# EAGLE design me433 (EAGLE 9.6.2)
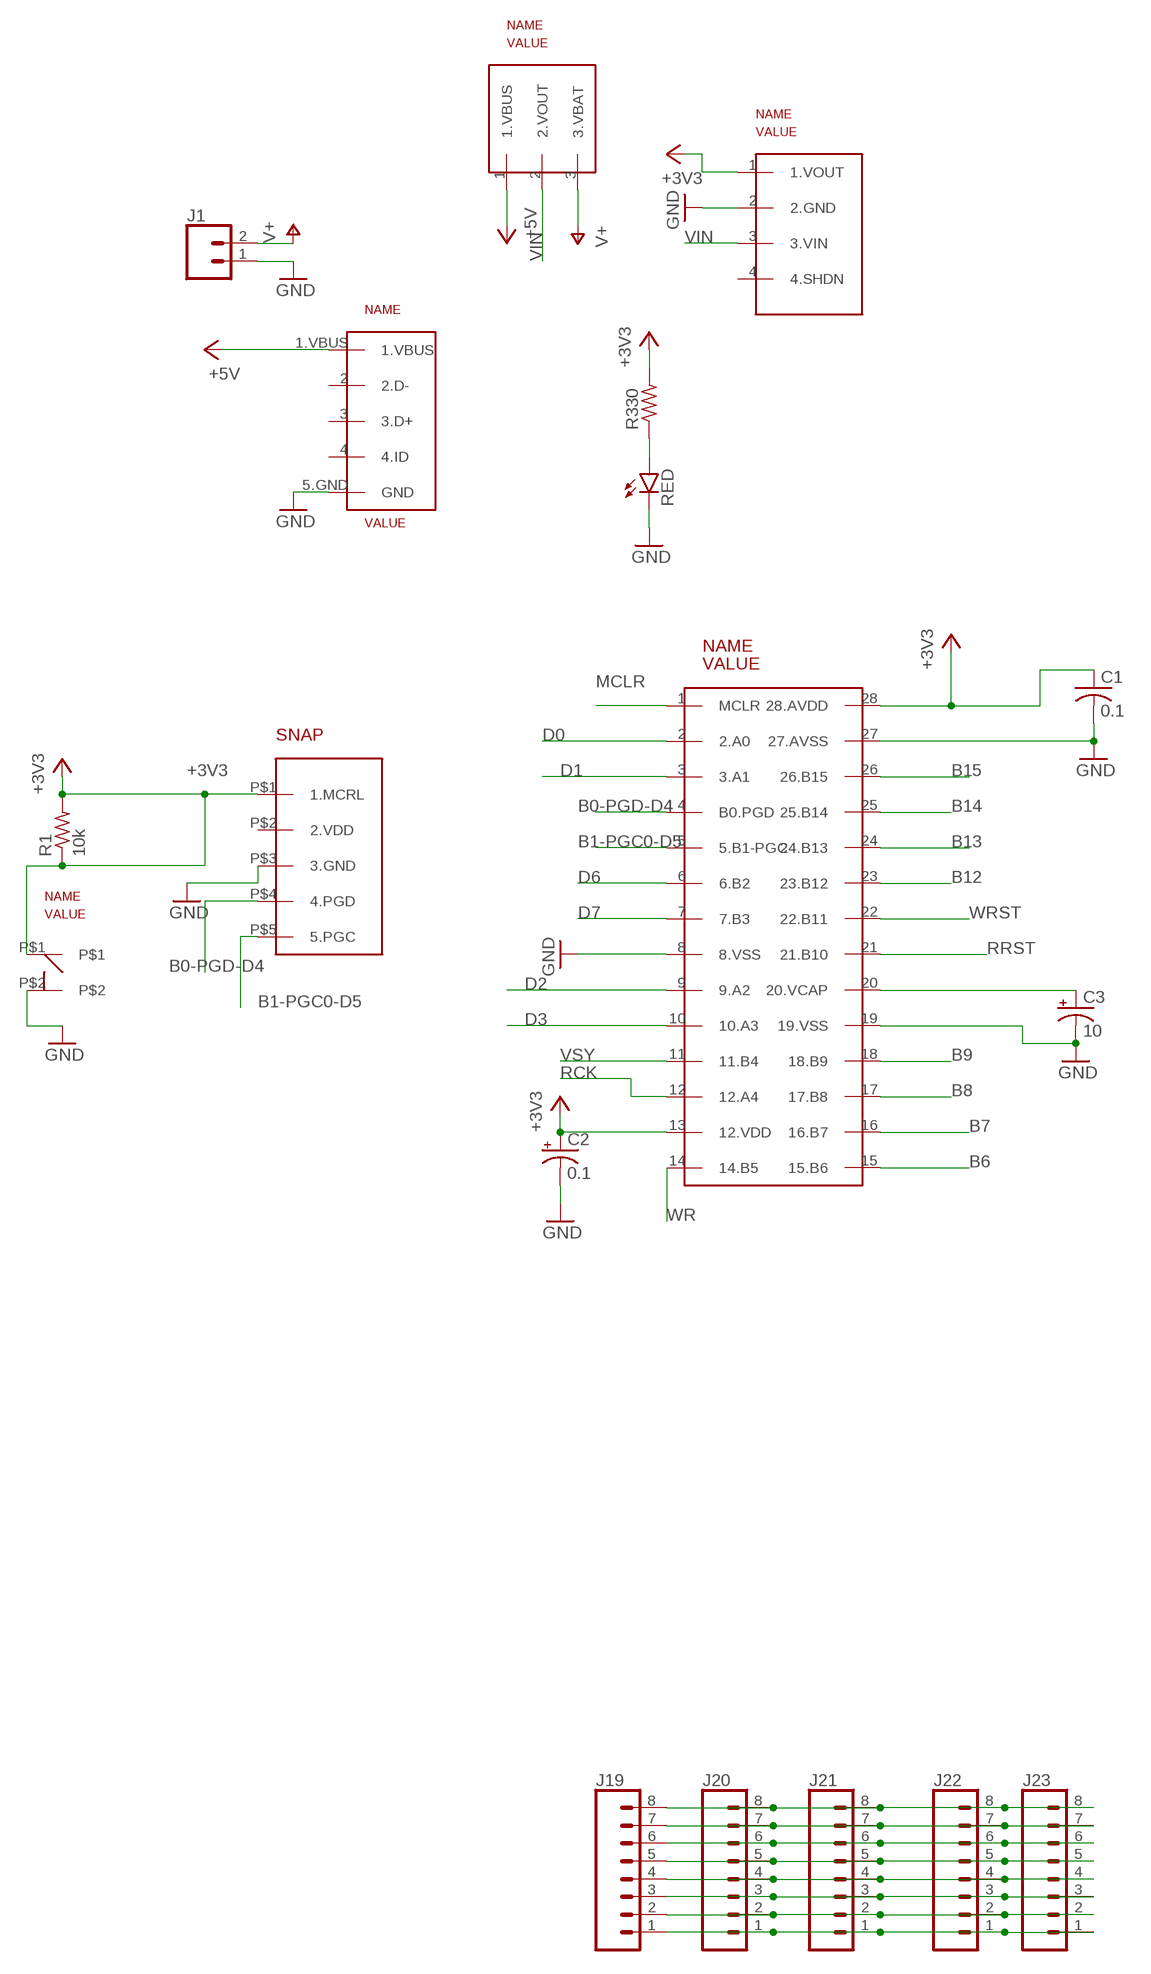
[diagram p0: schematic, sheet 1, part 1 of 2]
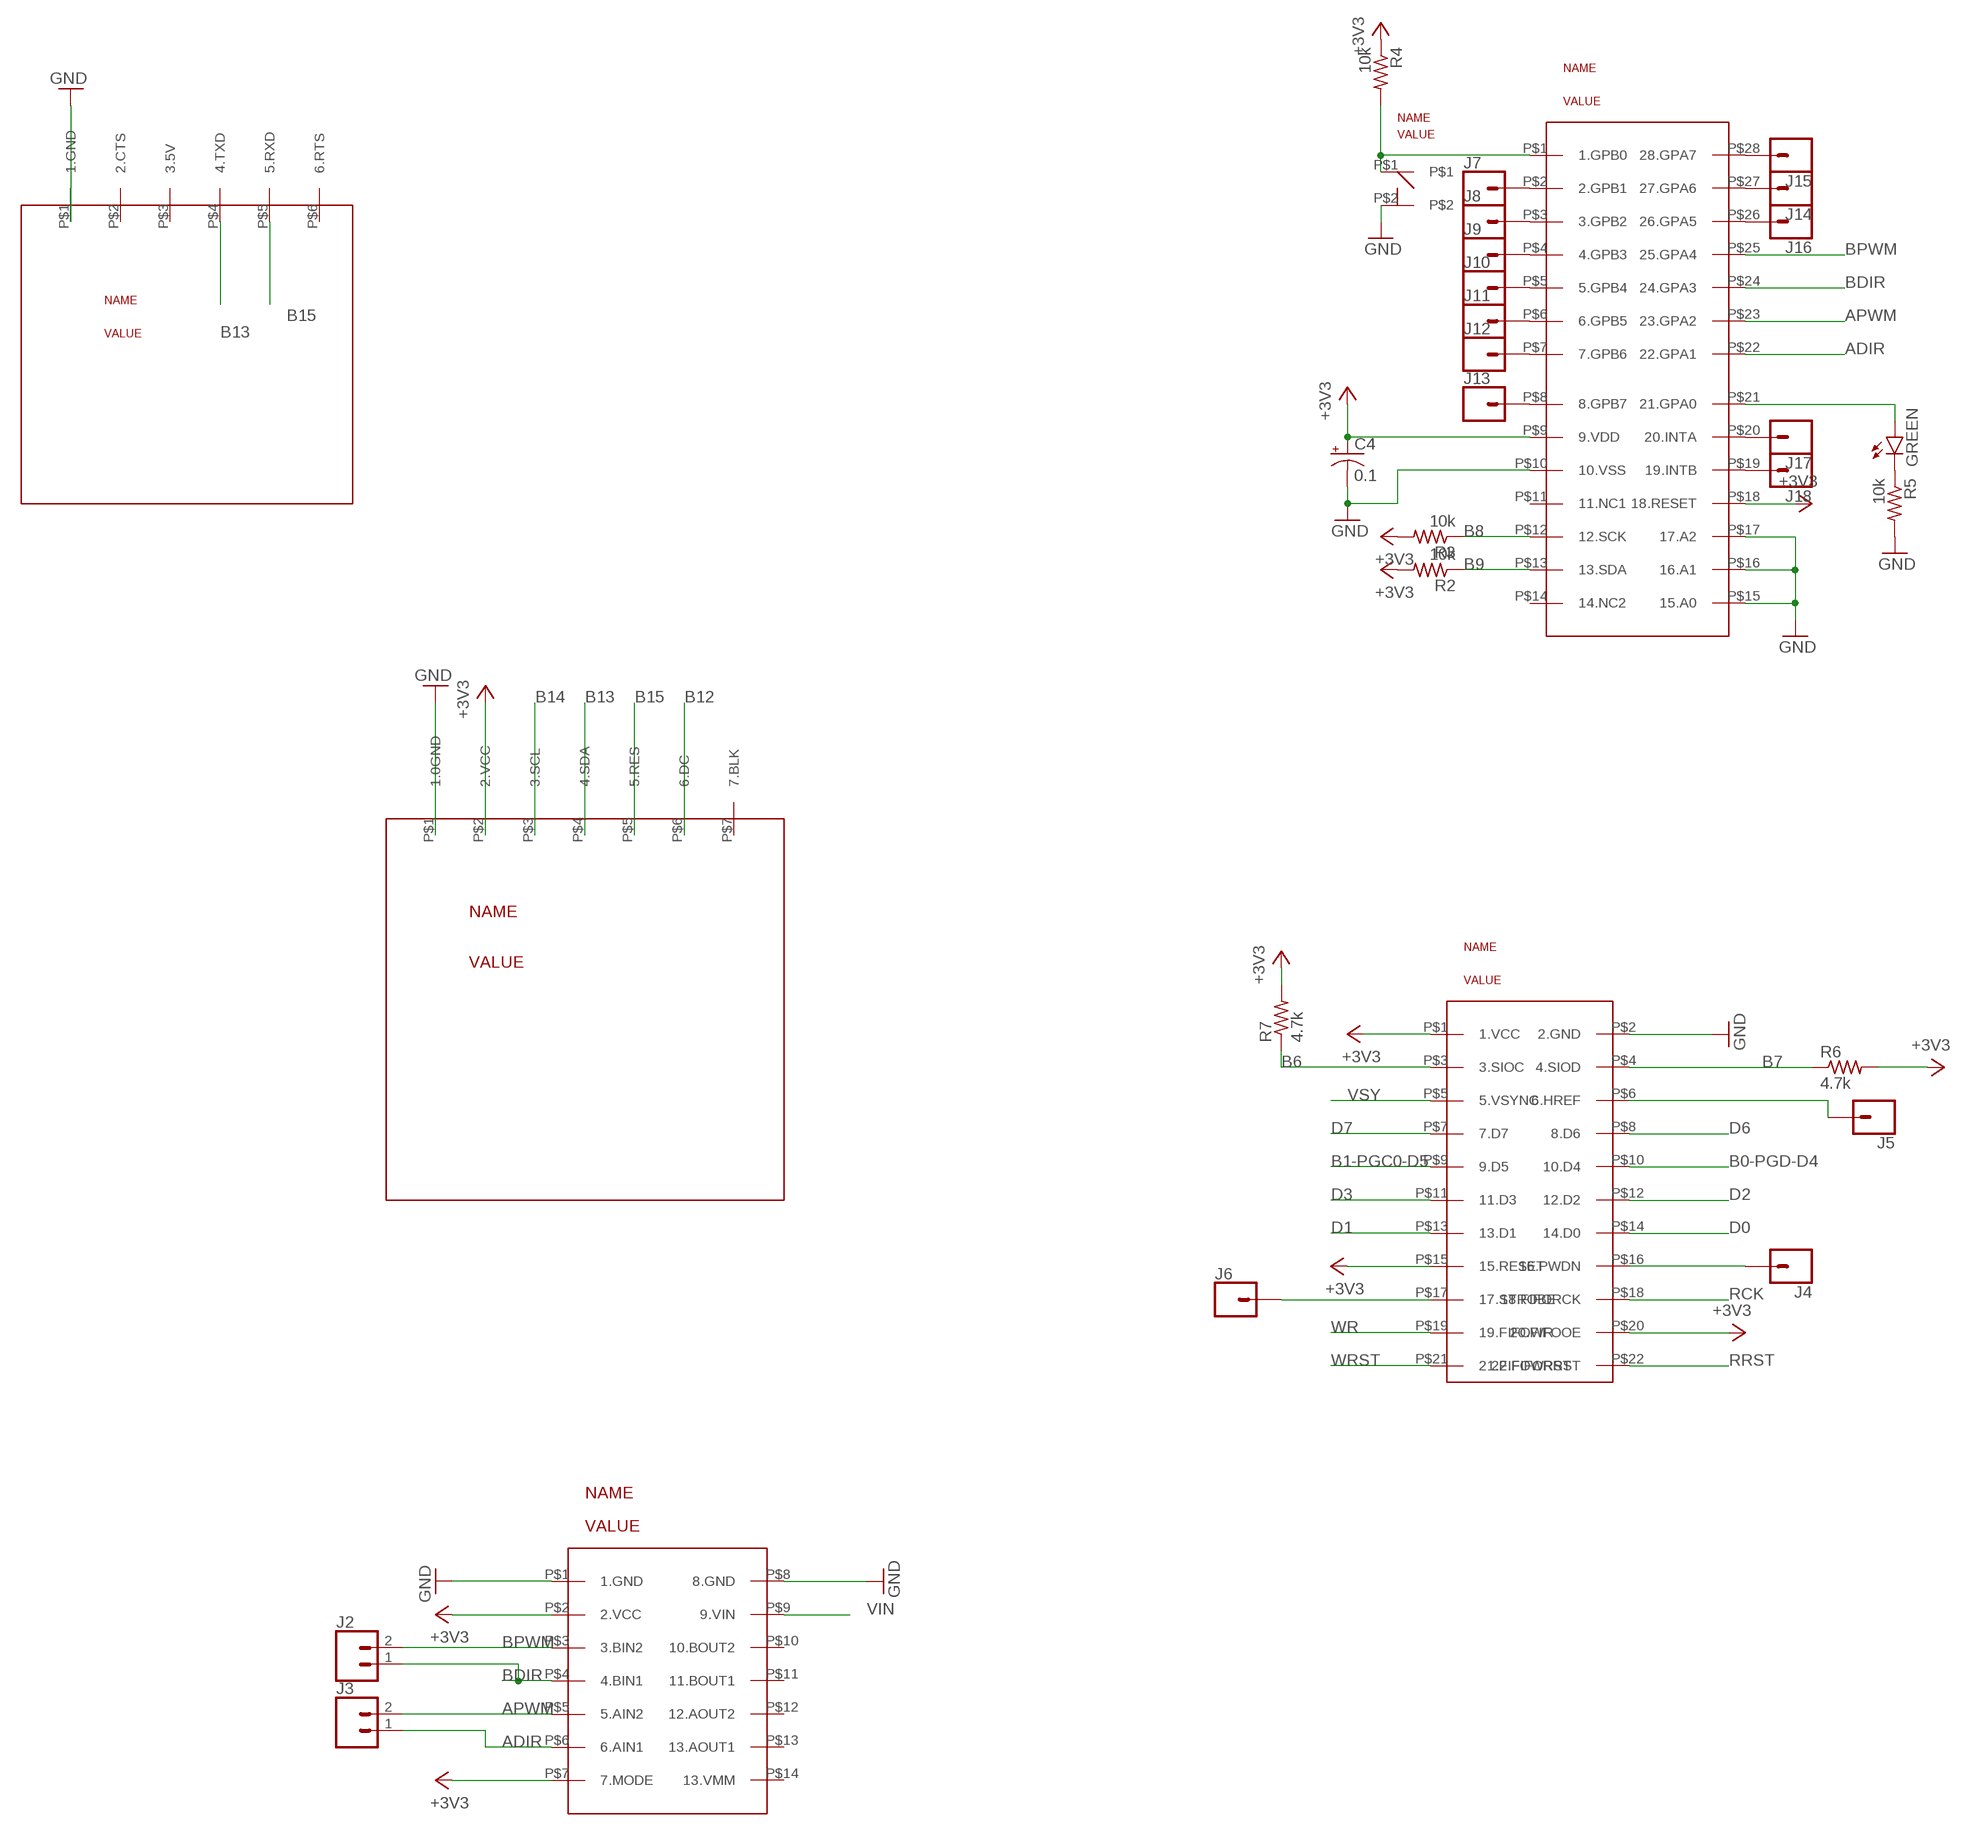
[diagram p1: schematic, sheet 1, part 2 of 2]

## Parts
C1  0.1  C-US025-030X050  [C025-030X050]
C2  0.1  CPOL-USB45181C  [B45181C]
C3  10  CPOL-USB45181C  [B45181C]
C4  0.1  CPOL-USB45181C  [B45181C]
GREEN  LED3MM  [LED3MM]
HBRIDGE  H_BRIDGE  [H_BRIDGE]
J1  CONN_02  [1X02]
J2  CONN_02  [1X02]
J3  CONN_02  [1X02]
J4  CONN_01  [1X01]
J5  CONN_01  [1X01]
J6  CONN_01  [1X01]
J7  CONN_01  [1X01]
J8  CONN_01  [1X01]
J9  CONN_01  [1X01]
J10  CONN_01  [1X01]
J11  CONN_01  [1X01]
J12  CONN_01  [1X01]
J13  CONN_01  [1X01]
J14  CONN_01  [1X01]
J15  CONN_01  [1X01]
J16  CONN_01  [1X01]
J17  CONN_01  [1X01]
J18  CONN_01  [1X01]
J19  CONN_08"  [1X08]
J20  CONN_08"  [1X08]
J21  CONN_08"  [1X08]
J22  CONN_08"  [1X08]
J23  CONN_08"  [1X08]
R1  10k  R-US_0207/10  [0207/10]
R2  10k  R-US_0207/10  [0207/10]
R3  10k  R-US_0207/10  [0207/10]
R4  10k  R-US_0207/10  [0207/10]
R5  10k  R-US_0207/10  [0207/10]
R6  4.7k  R-US_0207/10  [0207/10]
R7  4.7k  R-US_0207/10  [0207/10]
R330  R-US_0207/10  [0207/10]
RED  LED3MM  [LED3MM]
RESET  PUSH  [PUSH]
U$1  PIC32  [DIL28-3]
U$2  MICROUSB  [MICROUSB]
U$3  POLULU3V3  [POLOLU3V3]
U$4  SLIDE  [SLIDE]
U$5  FIFO_CAMERA  [FIFO_CAMERA]
U$6  SNAP  [SNAP]
U$7  USB_CON  [USB_CON]
U$8  LCD  [LCD]
U$10  EXPANDER  [EXPANDER]
USER  PUSH  [PUSH]

## Nets
+3V3: C1.1 C2.+ C4.+ HBRIDGE.P$2(2.VCC) HBRIDGE.P$7(7.MODE) R1.1 R1.2 R2.2 R3.2 R4.1 R6.2 R7.2 R330.2 RESET.P$1 U$1.13(12.VDD) U$1.28(28.AVDD) U$3.1(1.VOUT) U$5.P$1(1.VCC) U$5.P$15(15.RESET) U$5.P$20(20.FIFOOE) U$6.P$1(1.MCRL) U$8.P$2(2.VCC) U$10.P$9(9.VDD) U$10.P$18(18.RESET)
+5V: U$2.1.VBUS U$4.1(1.VBUS)
ADIR: HBRIDGE.P$6(6.AIN1) J3.1 U$10.P$22(22.GPA1)
APWM: HBRIDGE.P$5(5.AIN2) J3.2 U$10.P$23(23.GPA2)
B0-PGD-D4: U$1.4(B0.PGD) U$5.P$10(10.D4) U$6.P$4(4.PGD)
B1-PGC0-D5: U$1.5(5.B1-PGC) U$5.P$9(9.D5) U$6.P$5(5.PGC)
B6: R7.1 U$1.15(15.B6) U$5.P$3(3.SIOC)
B7: R6.1 U$1.16(16.B7) U$5.P$4(4.SIOD)
B8: R3.1 U$1.17(17.B8) U$10.P$12(12.SCK)
B9: R2.1 U$1.18(18.B9) U$10.P$13(13.SDA)
B12: U$1.23(23.B12) U$8.P$6(6.DC)
B13: U$1.24(24.B13) U$7.P$4(4.TXD) U$8.P$4(4.SDA)
B14: U$1.25(25.B14) U$8.P$3(3.SCL)
B15: U$1.26(26.B15) U$7.P$5(5.RXD) U$8.P$5(5.RES)
BDIR: HBRIDGE.P$4(4.BIN1) J2.1 U$10.P$24(24.GPA3)
BPWM: HBRIDGE.P$3(3.BIN2) J2.2 U$10.P$25(25.GPA4)
D0: U$1.2(2.A0) U$5.P$14(14.D0)
D1: U$1.3(3.A1) U$5.P$13(13.D1)
D2: U$1.9(9.A2) U$5.P$12(12.D2)
D3: U$1.10(10.A3) U$5.P$11(11.D3)
D6: U$1.6(6.B2) U$5.P$8(8.D6)
D7: U$1.7(7.B3) U$5.P$7(7.D7)
GND: C1.2 C2.- C3.- C4.- HBRIDGE.P$1(1.GND) HBRIDGE.P$8(8.GND) J1.1 R5.2 RED.K(C) RESET.P$2 U$1.8(8.VSS) U$1.19(19.VSS) U$1.27(27.AVSS) U$2.5.GND(GND) U$3.2(2.GND) U$5.P$2(2.GND) U$6.P$3(3.GND) U$7.P$1(1.GND) U$8.P$1(1.0GND) U$10.P$10(10.VSS) U$10.P$15(15.A0) U$10.P$16(16.A1) U$10.P$17(17.A2) USER.P$2
MCLR: U$1.1(MCLR)
N$1: C3.+ U$1.20(20.VCAP)
N$2: R330.1 RED.A
N$3: GREEN.A U$10.P$21(21.GPA0)
N$4: R4.2 U$10.P$1(1.GPB0) USER.P$1
N$5: GREEN.K(C) R5.1
N$6: J6.1 U$5.P$17(17.STROBE)
N$7: J4.1 U$5.P$16(16.PWDN)
N$8: J5.1 U$5.P$6(6.HREF)
N$9: J7.1 U$10.P$2(2.GPB1)
N$10: J8.1 U$10.P$3(3.GPB2)
N$11: J9.1 U$10.P$4(4.GPB3)
N$12: J10.1 U$10.P$5(5.GPB4)
N$13: J11.1 U$10.P$6(6.GPB5)
N$14: J12.1 U$10.P$7(7.GPB6)
N$15: J13.1 U$10.P$8(8.GPB7)
N$16: J14.1 U$10.P$27(27.GPA6)
N$17: J15.1 U$10.P$28(28.GPA7)
N$18: J16.1 U$10.P$26(26.GPA5)
N$19: J17.1 U$10.P$20(20.INTA)
N$20: J18.1 U$10.P$19(19.INTB)
N$21: J19.8 J20.8 J21.8 J22.8 J23.8
N$22: J19.7 J20.7 J21.7 J22.7 J23.7
N$23: J19.6 J20.6 J21.6 J22.6 J23.6
N$24: J19.5 J20.5 J21.5 J22.5 J23.5
N$25: J19.4 J20.4 J21.4 J22.4 J23.4
N$26: J19.3 J20.3 J21.3 J22.3 J23.3
N$27: J19.2 J20.2 J21.2 J22.2 J23.2
N$28: J19.1 J20.1 J21.1 J22.1 J23.1
RCK: U$1.12(12.A4) U$5.P$18(18.FIFORCK)
RRST: U$1.21(21.B10) U$5.P$22(22.FIFORRST)
V+: J1.2 U$4.3(3.VBAT)
VIN: HBRIDGE.P$9(9.VIN) U$3.3(3.VIN) U$4.2(2.VOUT)
VSY: U$1.11(11.B4) U$5.P$5(5.VSYNC)
WR: U$1.14(14.B5) U$5.P$19(19.FIFOWR)
WRST: U$1.22(22.B11) U$5.P$21(21.FIFOWRST)
Unconnected: HBRIDGE.P$10(10.BOUT2) HBRIDGE.P$11(11.BOUT1) HBRIDGE.P$12(12.AOUT2) HBRIDGE.P$13(13.AOUT1) HBRIDGE.P$14(13.VMM) U$2.2(2.D-) U$2.3(3.D+) U$2.4(4.ID) U$3.4(4.SHDN) U$6.P$2(2.VDD) U$7.P$2(2.CTS) U$7.P$3(3.5V) U$7.P$6(6.RTS) U$8.P$7(7.BLK) U$10.P$11(11.NC1) U$10.P$14(14.NC2)

## Library data of the parts
C1 = library:C-US: CAPACITOR, American symbol; SPICEPREFIX: C
C2-C4 = library:CPOL-US: POLARIZED CAPACITOR, American symbol; SPICEPREFIX: C
GREEN RED = library:LED: LED OSRAM: - CHIPLED LG R971, LG N971, LY N971, LG Q971, LY Q971, LO R971, LY R971 LH N974, LH R974 LS Q976, LO Q976, LY Q976 LO Q996 - Hyper CHIPLED LW Q18S LB Q993, LB Q99A, LB R99A - SideLED LS A670, LO A670, LY A670, LG A670, LP A670 LB A673, LV A673, LT A673, LW A673 LH A674 LY A675 LS A676, LA A676, LO A676, LY A676, LW A676 LS A679, LY A679, LG A679 - Hyper Micro SIDELED® LS Y876, LA Y876, LO Y876, LY Y876 LT Y87S - SmartLED LW L88C, LW L88S LB L89C, LB L89S, LG L890 LS L89K, LO L89K, LY L89K LS L896, LA L896, LO L896, LY L896 - TOPLED LS T670, LO T670, LY T670, LG T670, LP T670 LSG T670, LSP T670, LSY T670, LOP T670, LYG T670 LG T671, LOG T671, LSG T671 LB T673, LV T673, LT T673, LW T673 LH T674 LS T676, LA T676, LO T676, LY T676, LB T676, LH T676, LSB T676, LW T676 LB T67C, LV T67C, LT T67C, LS T67K, LO T67K, LY T67K, LW E67C LS E67B, LA E67B, LO E67B, LY E67B, LB E67C, LV E67C, LT E67C LW T67C LS T679, LY T679, LG T679 LS T770, LO T770, LY T770, LG T770, LP T770 LB T773, LV T773, LT T773, LW T773 LH T774 LS E675, LA E675, LY E675, LS T675 LS T776, LA T776, LO T776, LY T776, LB T776 LHGB T686 LT T68C, LB T68C - Hyper Mini TOPLED® LB M676 - Mini TOPLED Santana® LG M470 LS M47K, LO M47K, LY M47K Source: http://www.osram.convergy.de LUXEON: - LUMILED® LXK2-PW12-R00, LXK2-PW12-S00, LXK2-PW14-U00, LXK2-PW14-V00 LXK2-PM12-R00, LXK2-PM12-S00, LXK2-PM14-U00 LXK2-PE12-Q00, LXK2-PE12-R00, LXK2-PE12-S00, LXK2-PE14-T00, LXK2-PE14-U00 LXK2-PB12-K00, LXK2-PB12-L00, LXK2-PB12-M00, LXK2-PB14-N00, LXK2-PB14-P00, LXK2-PB14-Q00 LXK2-PR12-L00, LXK2-PR12-M00, LXK2-PR14-Q00, LXK2-PR14-R00 LXK2-PD12-Q00, LXK2-PD12-R00, LXK2-PD12-S00 LXK2-PH12-R00, LXK2-PH12-S00 LXK2-PL12-P00, LXK2-PL12-Q00, LXK2-PL12-R00 Source: www.luxeon.com KINGBRIGHT: KA-3528ASYC Source: www.kingbright.com
HBRIDGE = library:H_BRIDGE
J1-J3 = library:CONN_02: Multi connection point. Often used as Generic Header-pin footprint for 0.1 inch spaced/style header connections On any of the 0.1 inch spaced packages, you can populate with these: Break Away Headers - Straight <https://www.sparkfun.com/products/116> (PRT-00116) Break Away Male Headers - Right Angle <https://www.sparkfun.com/products/553> (PRT-00553) Female Headers <https://www.sparkfun.com/products/115> (PRT-00115) Break Away Headers - Machine Pin <https://www.sparkfun.com/products/117> (PRT-00117) Break Away Female Headers - Swiss Machine Pin <https://www.sparkfun.com/products/743> (PRT-00743) For SCREWTERMINALS and SPRING TERMINALS visit here: Screw Terimnals on SparkFun.com <https://www.sparkfun.com/search/results?term=Screw+Terminals> (5mm/3.5mm/2.54mm spacing) This device is also useful as a general connection point to wire up your design to another part of your project. Our various solder wires solder well into these plated through hole pads. Hook-Up Wire - Assortment (Stranded, 22 AWG) <https://www.sparkfun.com/products/11375> (PRT-11375) Hook-Up Wire - Assortment (Solid Core, 22 AWG) <https://www.sparkfun.com/products/11367> (PRT-11367) View the entire wire category on our website here <https://www.sparkfun.com/categories/141> Special notes: Molex polarized connector foot print use with: PRT-08233 with associated crimp pins and housings. 2.54_SCREWTERM for use with PRT-10571. 3.5mm Screw Terminal footprints for PRT-08084 5mm Screw Terminal footprints for use with PRT-08432
J4-J18 = library:CONN_01: Single connection point. Often used as Generic Header-pin footprint for 0.1 inch spaced/style header connections On any of the 0.1 inch spaced packages, you can populate with these: Break Away Headers - Straight <https://www.sparkfun.com/products/116> (PRT-00116) Break Away Male Headers - Right Angle <https://www.sparkfun.com/products/553> (PRT-00553) Female Headers <https://www.sparkfun.com/products/115> (PRT-00115) Break Away Headers - Machine Pin <https://www.sparkfun.com/products/117> (PRT-00117) Break Away Female Headers - Swiss Machine Pin <https://www.sparkfun.com/products/743> (PRT-00743) This device is also useful as a general connection point to wire up your design to another part of your project. Our various solder wires solder well into these plated through hole pads. Hook-Up Wire - Assortment (Stranded, 22 AWG) <https://www.sparkfun.com/products/11375> (PRT-11375) Hook-Up Wire - Assortment (Solid Core, 22 AWG) <https://www.sparkfun.com/products/11367> (PRT-11367) View the entire wire category on our website here <https://www.sparkfun.com/categories/141> Special notes: SMTSO-256-ET is a "flush mount" nut for a 4-40 screw. We mostly use this on specialty testbeds; it is a nice way to connect hardware to your PCB at an adjustable hieght. Also note, the SNAP packages are for using a snappable style connector. We sell a baggie of snaps and they are also used on two LilyPad designs: Snap Assortment - 30 pack (male and female) <https://www.sparkfun.com/products/11347> (DEV-11347) LilyPad Arduino SimpleSnap <https://www.sparkfun.com/products/10941> (DEV-10941) LilyPad SimpleSnap Protoboard <https://www.sparkfun.com/products/10940> (DEV-10940)
J19-J23 = library:CONN_08: Multi connection point. Often used as Generic Header-pin footprint for 0.1 inch spaced/style header connections On any of the 0.1 inch spaced packages, you can populate with these: Break Away Headers - Straight <https://www.sparkfun.com/products/116> (PRT-00116) Break Away Male Headers - Right Angle <https://www.sparkfun.com/products/553> (PRT-00553) Female Headers <https://www.sparkfun.com/products/115> (PRT-00115) Break Away Headers - Machine Pin <https://www.sparkfun.com/products/117> (PRT-00117) Break Away Female Headers - Swiss Machine Pin <https://www.sparkfun.com/products/743> (PRT-00743) Arduino Stackable Header - 8 Pin <https://www.sparkfun.com/products/9279> (PRT-09279) For SCREWTERMINALS and SPRING TERMINALS visit here: Screw Terimnals on SparkFun.com <https://www.sparkfun.com/search/results?term=Screw+Terminals> (5mm/3.5mm/2.54mm spacing) This device is also useful as a general connection point to wire up your design to another part of your project. Our various solder wires solder well into these plated through hole pads. Hook-Up Wire - Assortment (Stranded, 22 AWG) <https://www.sparkfun.com/products/11375> (PRT-11375) Hook-Up Wire - Assortment (Solid Core, 22 AWG) <https://www.sparkfun.com/products/11367> (PRT-11367) View the entire wire category on our website here <https://www.sparkfun.com/categories/141> Special notes: Molex polarized connector foot print use with SKU : PRT-08231 with associated crimp pins and housings. 1MM SMD Version SKU: PRT-10208 NOTES ON THE VARIANTS LOCK and LOCK_LONGPADS... This footprint was designed to help hold the alignment of a through-hole component (i.e. 6-pin header) while soldering it into place. You may notice that each hole has been shifted either up or down by 0.005 of an inch from it's more standard position (which is a perfectly straight line). This slight alteration caused the pins (the squares in the middle) to touch the edges of the holes. Because they are alternating, it causes a "brace" to hold the component in place. 0.005 has proven to be the perfect amount of "off-center" position when using our standard breakaway headers. Although looks a little odd when you look at the bare footprint, once you have a header in there, the alteration is very hard to notice. Also,if you push a header all the way into place, it is covered up entirely on the bottom side.; PROD_ID: CONN-08438
R1-R7 R330 = library:R-US_: RESISTOR, American symbol; SPICEPREFIX: R
RESET USER = library:PUSH
U$1 = library:PIC32
U$2 = library:MICROUSB
U$3 = library:POLULU3V3
U$4 = library:SLIDE
U$5 = library:FIFO_CAMERA
U$6 = library:SNAP
U$7 = library:USB_CON
U$8 = library:LCD
U$10 = library:EXPANDER

## Board
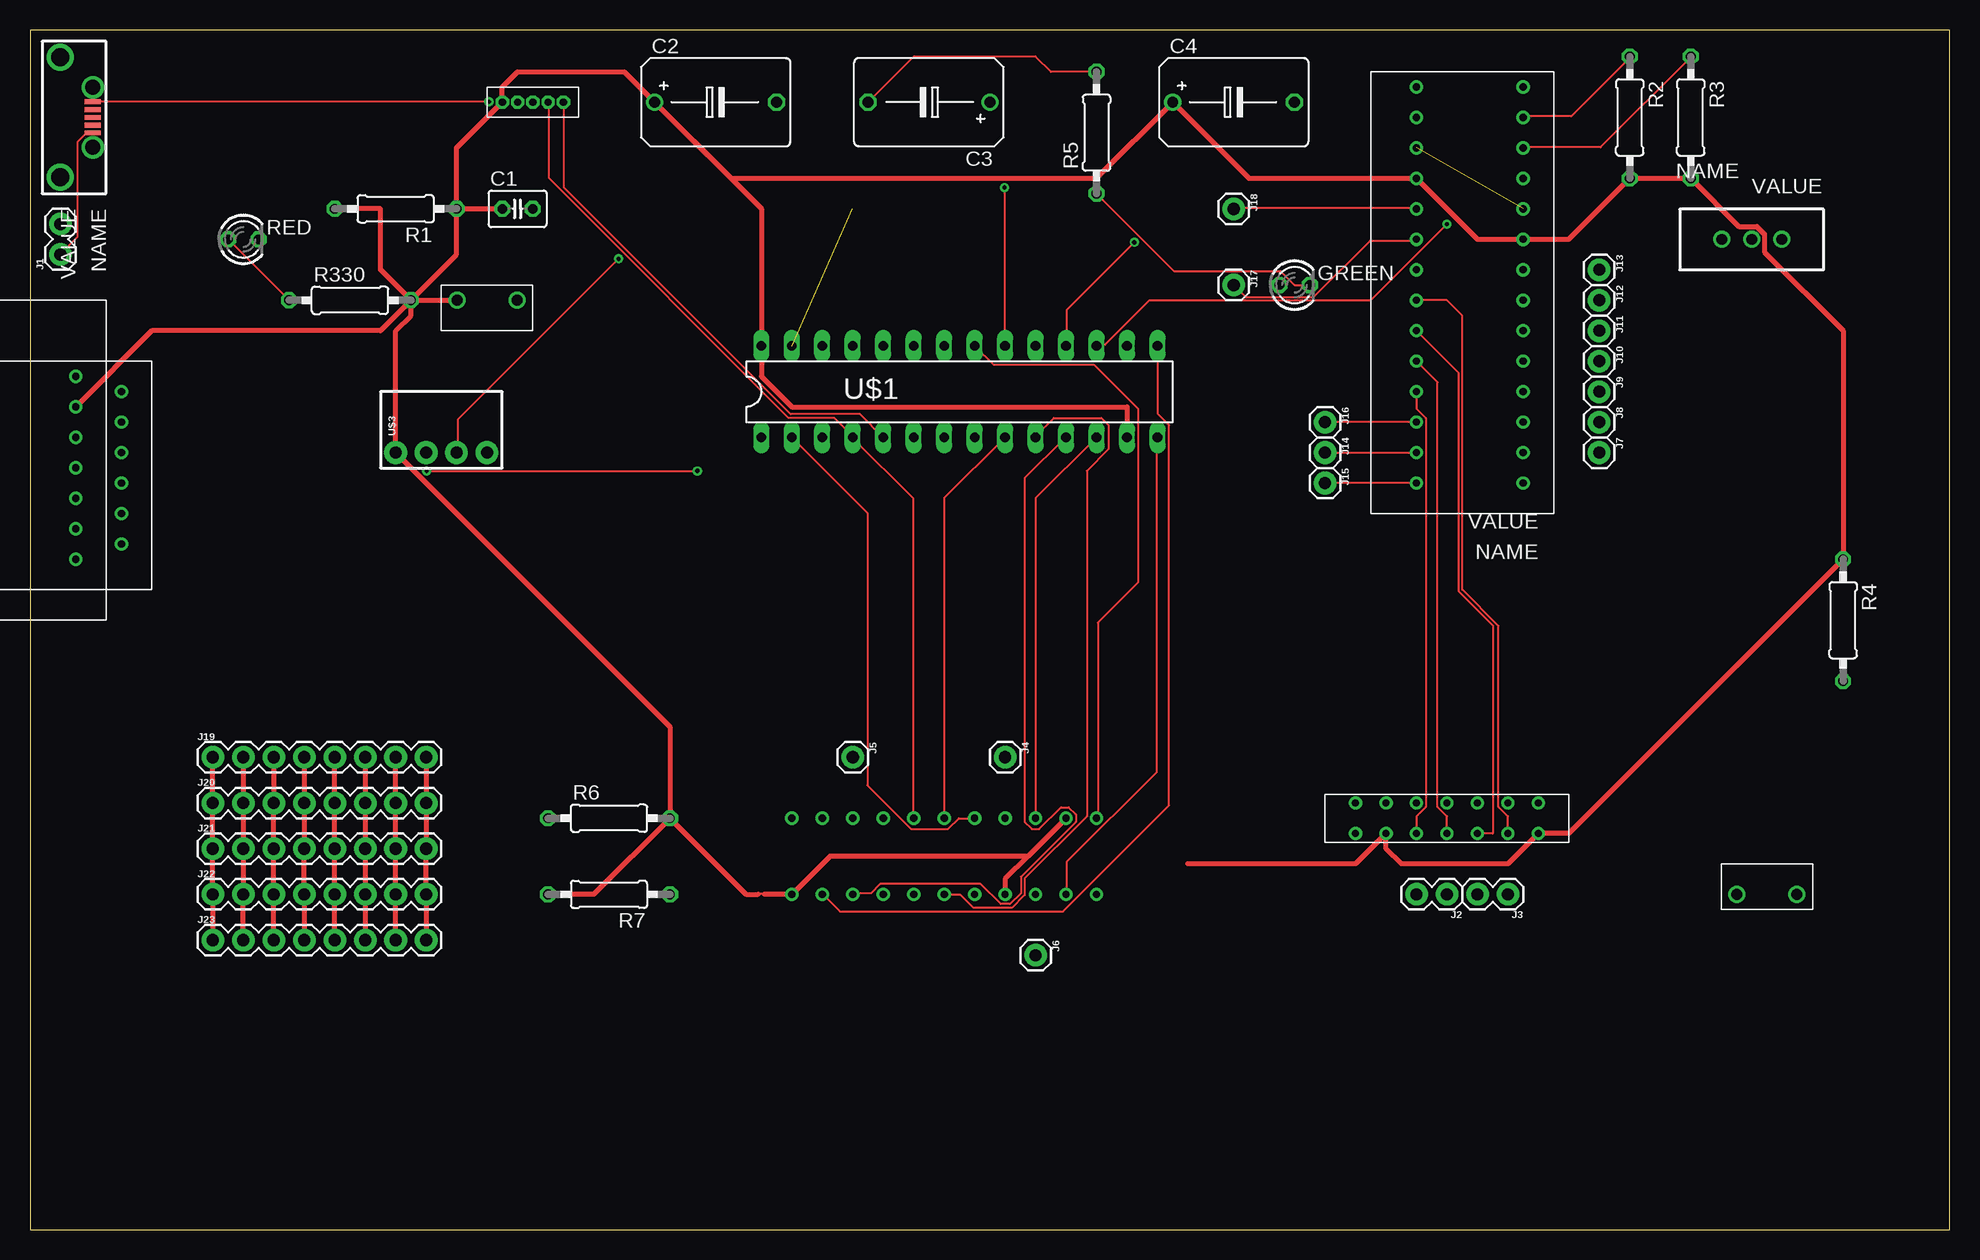
[diagram p2: board, top side]
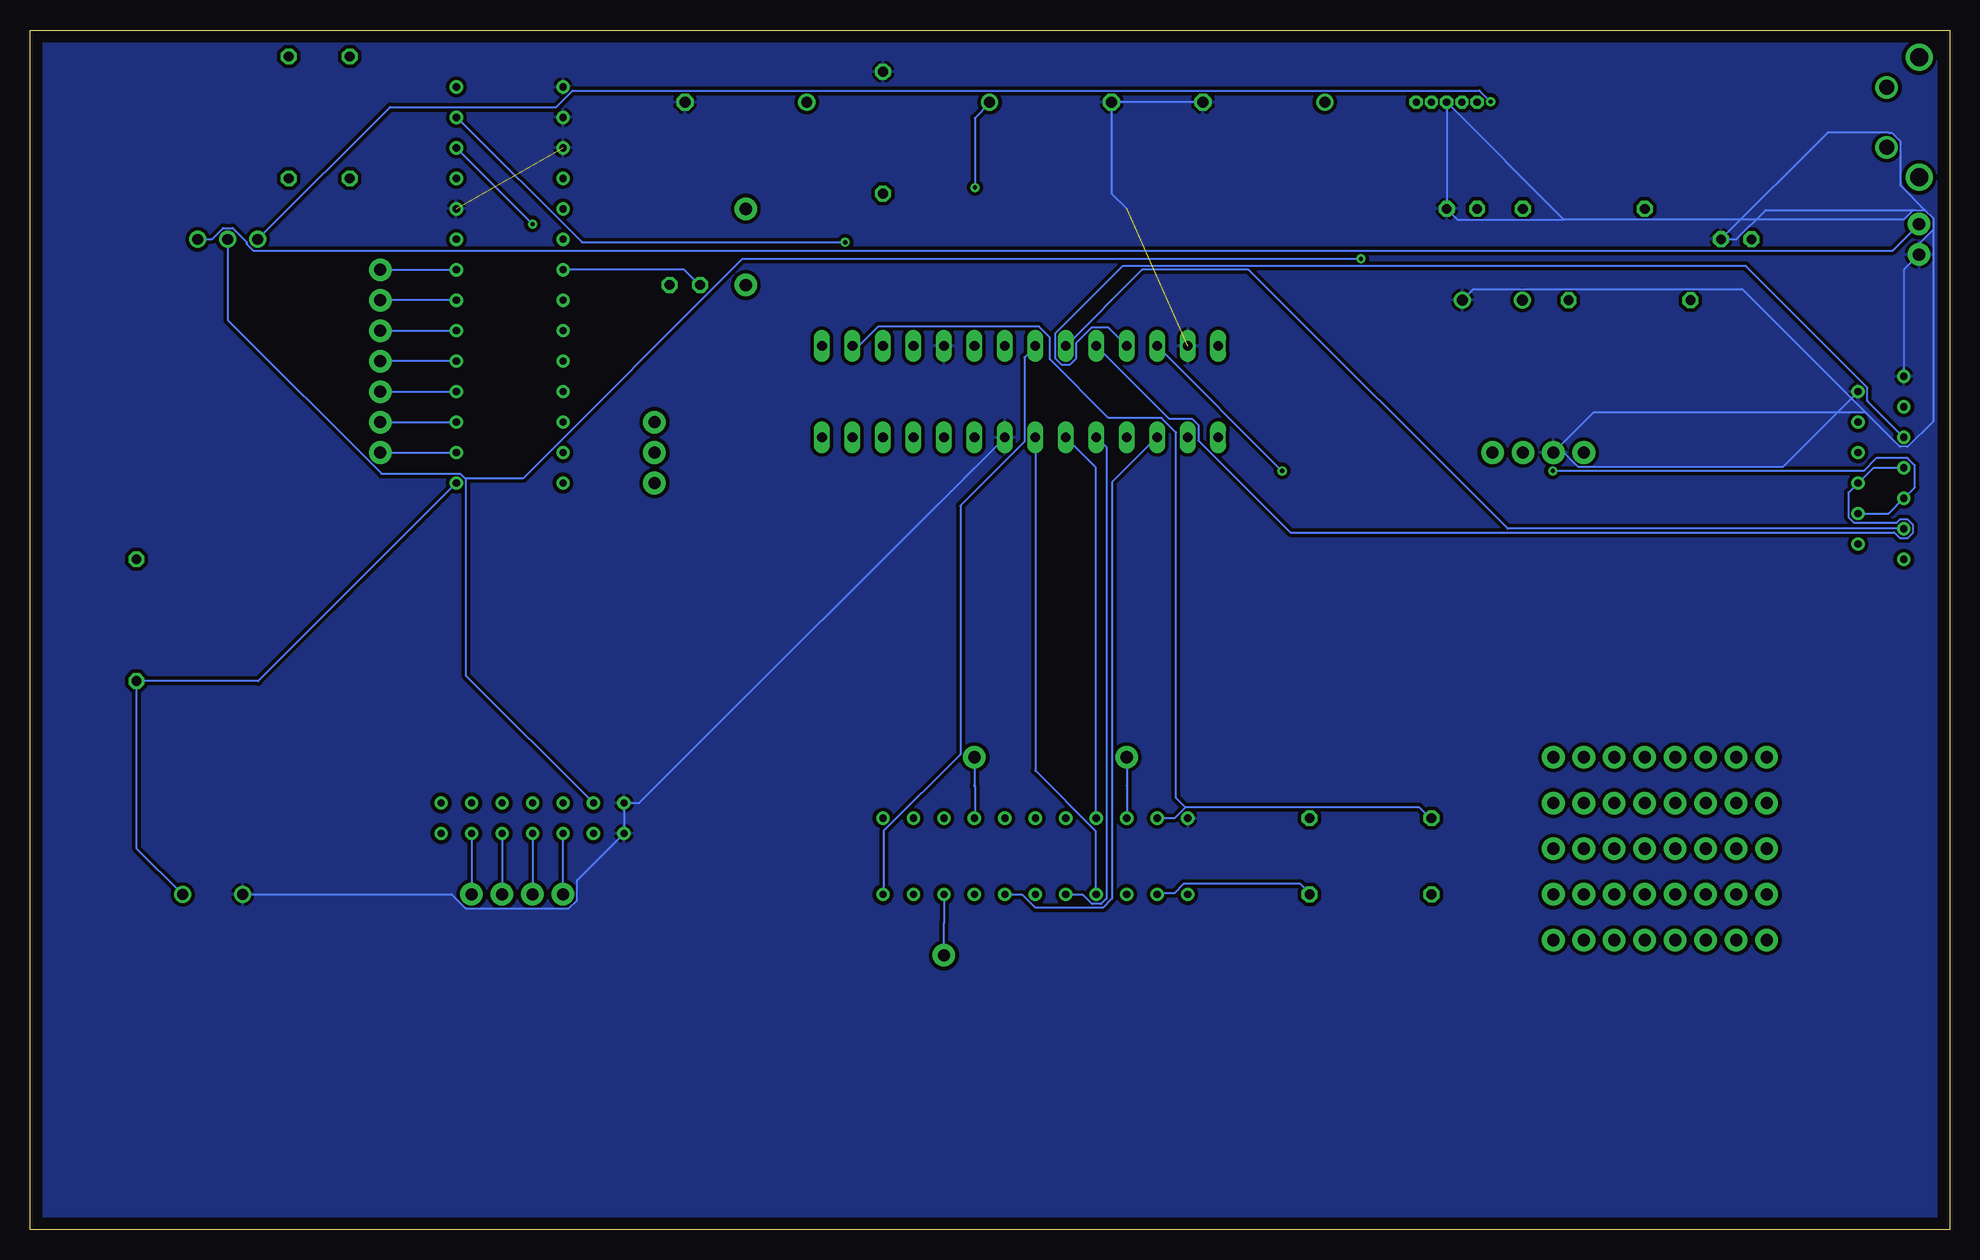
[diagram p3: board, bottom side, seen from below]

Size 160 x 100 mm. Coordinates in mm from the lower left corner, seen from the top.
Outline: 0,0 160,0 160,100 0,100 0,0
Copper layers (1*16): Top 0.035mm / dielectric 1.5mm / Bottom 0.035mm
Design rules "default": minimum track width 6mil, minimum drill 0.35mm, track to track 6mil, track to pad 6mil, pad to pad 6mil, via to via 6mil, smd to smd 6mil, copper to edge 40mil, drill to drill 6mil, minimum pad ring 10mil, minimum via ring 8mil, stop-mask expansion 4mil, vias tented up to drill 0mil, thermal gap 10mil

### Footprints (pad centres in the part's own frame; a part is rotated, then mirrored left to right if it is on the bottom)
C025-030X050 = drill 0.813 octagon: 1 -1.27,0; 2 1.27,0
B45181C = drill 0.914: + -5.08,0 | drill 0.914 octagon: - 5.08,0
LED3MM = drill 0.813 octagon: A -1.27,0; K 1.27,0
H_BRIDGE = drill 0.6: P$1 -1.27,7.62; P$2 -1.27,5.08; P$3 -1.27,2.54; P$4 -1.27,0; P$5 -1.27,-2.54; P$6 -1.27,-5.08; P$7 -1.27,-7.62; P$8 1.27,7.62; P$9 1.27,5.08; P$10 1.27,2.54; P$11 1.27,0; P$12 1.27,-2.54; P$13 1.27,-5.08; P$14 1.27,-7.62
1X02 = drill 1.016 pad 1.88: 1 0,0; 2 2.54,0
1X01 = drill 1.016 pad 1.88: 1 0,0
1X08 = drill 1.016 pad 1.88: 1 0,0; 2 2.54,0; 3 5.08,0; 4 7.62,0; 5 10.16,0; 6 12.7,0; 7 15.24,0; 8 17.78,0
0207/10 = drill 0.813 octagon: 1 -5.08,0; 2 5.08,0
PUSH = drill 0.9: P$1 -2.5,0; P$2 2.5,0
DIL28-3 = drill 0.813 long: 1 -16.51,-3.81; 2 -13.97,-3.81; 3 -11.43,-3.81; 4 -8.89,-3.81; 5 -6.35,-3.81; 6 -3.81,-3.81; 7 -1.27,-3.81; 8 1.27,-3.81; 9 3.81,-3.81; 10 6.35,-3.81; 11 8.89,-3.81; 12 11.43,-3.81; 13 13.97,-3.81; 14 16.51,-3.81; 15 16.51,3.81; 16 13.97,3.81; 17 11.43,3.81; 18 8.89,3.81; 19 6.35,3.81; 20 3.81,3.81; 21 1.27,3.81; 22 -1.27,3.81; 23 -3.81,3.81; 24 -6.35,3.81; 25 -8.89,3.81; 26 -11.43,3.81; 27 -13.97,3.81; 28 -16.51,3.81
MICROUSB = smd 0.4 x 1.35: 1.VBUS -1.3,2.7; 2 -0.65,2.7; 3 0,2.7; 4 0.65,2.7; 5.GND 1.3,2.7 | drill 1.25 pad 1.676: P$6 -2.5,2.7; P$7 2.5,2.7 | drill 1.5: P$8 -5,0; P$9 5,0
POLOLU3V3 = drill 1.016 pad 1.88: 1 -3.81,0; 2 -1.27,0; 3 1.27,0; 4 3.81,0
SLIDE = drill 0.9: 1 -2.5,0; 2 0,0; 3 2.5,0
FIFO_CAMERA = drill 0.6: P$1 -3.81,10.16; P$2 2.54,10.16; P$3 -3.81,7.62; P$4 2.54,7.62; P$5 -3.81,5.08; P$6 2.54,5.08; P$7 -3.81,2.54; P$8 2.54,2.54; P$9 -3.81,0; P$10 2.54,0; P$11 -3.81,-2.54; P$12 2.54,-2.54; P$13 -3.81,-5.08; P$14 2.54,-5.08; P$15 -3.81,-7.62; P$16 2.54,-7.62; P$17 -3.81,-10.16; P$18 2.54,-10.16; P$19 -3.81,-12.7; P$20 2.54,-12.7; P$21 -3.81,-15.24; P$22 2.54,-15.24
SNAP = drill 0.6 octagon: P$1 0,3.81; P$2 0,2.54; P$3 0,1.27; P$4 0,0; P$5 0,-1.27
USB_CON = drill 0.6: P$1 -8.89,2.54; P$2 -6.35,2.54; P$3 -3.81,2.54; P$4 -1.27,2.54; P$5 1.27,2.54; P$6 3.81,2.54
LCD = drill 0.6: P$1 -7.62,2.54; P$2 -5.08,2.54; P$3 -2.54,2.54; P$4 0,2.54; P$5 2.54,2.54; P$6 5.08,2.54; P$7 7.62,2.54
EXPANDER = drill 0.6: P$1 -6.35,12.7; P$2 -6.35,10.16; P$3 -6.35,7.62; P$4 -6.35,5.08; P$5 -6.35,2.54; P$6 -6.35,0; P$7 -6.35,-2.54; P$8 -6.35,-5.08; P$9 -6.35,-7.62; P$10 -6.35,-10.16; P$11 -6.35,-12.7; P$12 -6.35,-15.24; P$13 -6.35,-17.78; P$14 -6.35,-20.32; P$15 2.54,-20.32; P$16 2.54,-17.78; P$17 2.54,-15.24; P$18 2.54,-12.7; P$19 2.54,-10.16; P$20 2.54,-7.62; P$21 2.54,-5.08; P$22 2.54,-2.54; P$23 2.54,0; P$24 2.54,2.54; P$25 2.54,5.08; P$26 2.54,7.62; P$27 2.54,10.16; P$28 2.54,12.7

### Placement (x,y rotation side)
C1  40.64,85.09 0 top
C2  57.15,93.98 0 top
C3  74.93,93.98 180 top
C4  100.33,93.98 0 top
GREEN  105.41,78.74 0 top
HBRIDGE  118.11,34.29 90 top
J1  2.54,81.28 90 top
J2  118.11,27.94 180 top
J3  123.19,27.94 180 top
J4  81.28,39.37 270 top
J5  68.58,39.37 270 top
J6  83.82,22.86 270 top
J7  130.81,64.77 270 top
J8  130.81,67.31 270 top
J9  130.81,69.85 270 top
J10  130.81,72.39 270 top
J11  130.81,74.93 270 top
J12  130.81,77.47 270 top
J13  130.81,80.01 270 top
J14  107.95,64.77 270 top
J15  107.95,62.23 270 top
J16  107.95,67.31 270 top
J17  100.33,78.74 270 top
J18  100.33,85.09 270 top
J19  15.24,39.37 0 top
J20  15.24,35.56 0 top
J21  15.24,31.75 0 top
J22  15.24,27.94 0 top
J23  15.24,24.13 0 top
R1  30.48,85.09 180 top
R2  133.35,92.71 270 top
R3  138.43,92.71 270 top
R4  151.13,50.8 270 top
R5  88.9,91.44 90 top
R6  48.26,34.29 0 top
R7  48.26,27.94 180 top
R330  26.67,77.47 0 top
RED  17.78,82.55 0 top
RESET  38.1,77.47 0 top
U$1  77.47,69.85 0 top
U$2  2.54,92.71 270 top
U$3  34.29,64.77 0 top
U$4  143.51,82.55 0 top
U$5  73.66,31.75 90 top
U$6  43.18,93.98 90 top
U$7  5.08,60.96 270 top
U$8  1.27,63.5 270 top
U$10  118.11,74.93 180 top
USER  144.78,27.94 180 top

### Tracks (layer width: path | path; a pad name or v marks a point on that pad's centre or on a via)
+3V3
  Top 0.152: 61.23,27.94 61.11,28.04 60.81,28.04 60.69,27.94
  Top 0.406: R330.2 31.75,76.2 30.48,74.93 U$3.1 53.34,41.91 R6.2 | R330.2 RESET.P$1 | R330.2 29.21,80.01 29.21,85.09 R1.2 | R330.2 35.56,81.28 R1.1 | R1.1 C1.1 | R1.1 35.56,90.17 U$6.P$1 39.37,95.25 40.64,96.52 49.53,96.52 C2.+ | C2.+ 60.96,85.09 U$1.28 60.96,71.12 63.5,68.58 91.44,68.58 U$1.13 | R330.2 29.21,74.93 10.16,74.93 U$8.P$2 | R6.2 46.99,27.94 R7.2 | R6.2 59.69,27.94 60.69,27.94 | C2.+ 58.42,87.63 88.9,87.63 C4.+ 101.6,87.63 U$10.P$18 120.65,82.55 U$10.P$9 128.27,82.55 R2.2 R3.2 142.45,83.61 143.95,83.61 144.57,82.99 144.57,81.49 151.13,74.93 R4.1 128.27,33.02 HBRIDGE.P$7 123.19,30.48 114.3,30.48 113.03,31.75 HBRIDGE.P$2 110.49,30.48 96.52,30.48 | U$5.P$20 83.19,31.11 | 83.19,31.11 81.28,29.21 U$5.P$15 | 83.19,31.11 66.67,31.11 U$5.P$1 61.23,27.94
+5V  (via drill 0.35)
  Top 0.152: v38.25,94.03 5.33,94.03 U$2.1.VBUS
  Bottom 0.152: v38.25,94.03 39.17,94.94 114.76,94.94 116.13,93.57 130,93.57 140.97,82.6 U$4.1
ADIR
  Top 0.152: HBRIDGE.P$6 123.19,34.45 122.41,35.24 122.41,50.31 119.38,53.34 119.38,76.2 118.11,77.47 U$10.P$22
  Bottom 0.152: HBRIDGE.P$6 J3.1
APWM
  Top 0.152: U$10.P$23 119.08,71.42 119.08,53.21 121.92,50.37 121.92,33.02 HBRIDGE.P$5
  Bottom 0.152: HBRIDGE.P$5 J3.2
B0-PGD-D4
  Top 0.152: U$6.P$4 43.28,93.88 43.28,87.63 63.25,67.67 67.06,67.67 68.58,66.14 U$1.4 68.58,65.99 73.61,60.96 73.61,34.29 U$5.P$10
B1-PGC0-D5
  Top 0.152: U$1.5 69.19,67.97 63.4,67.97 44.5,86.87 44.5,93.88 U$6.P$5
  Bottom 0.152: U$5.P$9 73.61,27.89 72.24,27.89 71.48,27.13 70.71,27.13 70.26,27.58 70.26,65.23 71.02,65.99 U$1.5
B6
  Top 0.152: U$1.15 94.03,73.61 94.03,67.97 94.94,67.06 94.94,35.36 86.11,26.52 67.51,26.52 66.14,27.89 U$5.P$3
  Bottom 0.152: U$5.P$3 65.99,28.04 64.62,28.04 63.86,28.8 54.1,28.8 53.34,28.04 R7.1
B7
  Bottom 0.152: U$5.P$4 64.62,34.29 63.7,35.2 | 63.7,35.2 44.2,35.2 43.28,34.29 R6.1 | 63.7,35.2 64.47,35.97 64.47,66.45 65.68,67.67 70.1,67.67 74.98,72.54 74.98,74.37 75.89,75.29 89.31,75.29 90.83,73.76 91.44,73.76 U$1.16
B8  (via drill 0.35)
  Top 0.152: U$10.P$12 124.51,90.22 130.91,90.22 138.38,97.69 R3.1 | v118.11,83.82 111.71,77.42 93.27,77.42 89.61,73.76 89,73.76 U$1.17
  Bottom 0.152: U$10.P$12 v118.11,83.82
B9  (via drill 0.35)
  Top 0.152: U$10.P$13 124.51,92.81 128.47,92.81 133.35,97.69 R2.1 | v92.05,82.3 86.41,76.66 86.41,73.76 U$1.18
  Bottom 0.152: v92.05,82.3 114,82.3 124.36,92.66 U$10.P$13
B12
  Bottom 0.152: U$8.P$6 36.83,58.42 58.42,80.01 67.31,80.01 U$1.23
B13
  Bottom 0.152: U$8.P$4 6.35,63.5 U$7.P$4 8.4,61.45 8.4,59.37 7.94,58.91 4.43,58.91 4.13,59.2 3.49,59.2 3.03,58.74 3.03,58.1 3.49,57.64 4.13,57.64 4.61,58.12 54.95,58.12 62.61,65.77 62.61,67.07 63.13,67.59 65.05,67.59 U$1.24
B14
  Bottom 0.152: U$8.P$3 6.84,69.07 6.84,70.17 16.98,80.31 68.92,80.31 74.55,74.69 74.55,72.63 74.03,72.11 73.29,72.11 72.77,72.63 72.77,73.93 71.49,75.21 70.13,75.21 U$1.25
B15  (via drill 0.35)
  Top 0.152: v33.07,63.25 v55.63,63.25
  Bottom 0.152: U$7.P$5 5.08,59.69 U$8.P$5 2.9,61.87 2.9,63.7 3.5,64.31 6.1,64.31 7.16,63.25 v33.07,63.25 | v55.63,63.25 U$1.26
BDIR
  Top 0.152: HBRIDGE.P$4 118.11,34.45 117.33,35.24 117.33,70.63 U$10.P$24
  Bottom 0.152: HBRIDGE.P$4 J2.1
BPWM
  Top 0.152: U$10.P$25 115.57,68.42 116.35,67.63 116.35,35.24 115.57,34.45 HBRIDGE.P$3
  Bottom 0.152: J2.2 HBRIDGE.P$3
D0
  Top 0.152: U$5.P$14 77.42,34.29 76.5,33.38 73.46,33.38 69.8,37.03 69.8,59.74 U$1.2
D1
  Bottom 0.152: U$5.P$13 78.64,27.89 77.27,27.89 76.2,26.82 70.56,26.82 69.8,27.58 69.8,62.33 66.14,65.99 U$1.3
D2
  Top 0.152: U$5.P$12 76.2,60.96 U$1.9
D3
  Top 0.152: U$5.P$11 76.2,27.89 77.57,27.89 78.64,26.82 81.84,26.82 82.91,27.89 82.91,29.26 88.09,34.44 88.09,63.25 89.92,65.08 89.92,67.06 89.31,67.67 85.34,67.67 83.82,66.14 U$1.10
D6
  Bottom 0.152: U$1.6 71.17,63.55 71.17,34.29 U$5.P$8
D7
  Bottom 0.152: U$1.7 76.2,38.25 71.17,33.22 71.17,28.04 U$5.P$7
GND  (2 unrouted)
  Top 0.152: R5.2 85.09,96.52 83.82,97.79 73.66,97.79 C3.- | U$2.5.GND 5.18,91.44 4.72,91.44 3.96,90.68 3.96,82.75 2.59,81.38 J1.1
  Bottom 0.152: J1.1 3.81,80.01 U$8.P$1 | 2.06,84.99 4.07,87.01 4.07,90.69 4.76,91.38 5.02,91.38 5.08,91.44 10.16,91.44 RED.K 17.77,82.55 15.33,84.99 3.02,84.99 | J1.1 2.54,82.17 1.37,83.34 | RESET.P$2 39.67,78.4 17.28,78.4 6.97,68.09 | 32.13,84.2 3.81,84.2 3.02,84.99 | 32.13,84.2 U$6.P$3 C1.2 41.02,84.2 32.13,84.2 | 3.02,84.99 2.06,84.99 | 2.06,84.99 1.37,84.3 1.37,83.34 | 6.97,68.09 4.13,65.26 3.49,65.26 1.37,67.37 1.37,83.34 | 6.97,68.09 29.7,68.09 U$3.2 32.13,64.77 30.96,63.6 13.87,63.6 U$7.P$1 | USER.P$2 124.84,27.94 123.67,26.77 115.09,26.77 114.4,27.46 114.4,29.11 HBRIDGE.P$1 HBRIDGE.P$8 109.22,35.56 U$1.8 | C2.- C3.- 69.85,86.36 68.58,85.09 | 2.59,81.38 J1.1
  pour Bottom (isolate 0.305): 160.02,0 160.02,100.33 0,100.33 0,0
N$1  (via drill 0.35)
  Top 0.152: v81.23,86.87 81.23,73.76 U$1.20
  Bottom 0.152: v81.23,86.87 81.23,92.66 80.01,93.88 C3.+
N$2
  Top 0.152: RED.A R330.1
N$3
  Bottom 0.152: U$10.P$21 105.46,80.01 104.24,78.79 GREEN.A
N$4
  Bottom 0.152: U$10.P$1 140.97,45.72 R4.2 151.13,31.79 USER.P$1
N$5
  Top 0.152: GREEN.K 105.4,78.74 104.23,79.91 95.35,79.91 R5.1
N$6
  Bottom 0.152: U$5.P$17 83.82,25.6 83.82,25.54 J6.1
N$7
  Bottom 0.152: J4.1 81.28,37.03 | 81.28,37.03 81.28,36.97 | U$5.P$16 81.23,34.29 81.23,37.03 81.28,37.03
N$8
  Bottom 0.152: J5.1 68.58,37.03 68.58,36.97 U$5.P$6
N$9
  Bottom 0.152: J7.1 U$10.P$2
N$10
  Bottom 0.152: J8.1 U$10.P$3
N$11
  Bottom 0.152: J9.1 U$10.P$4
N$12
  Bottom 0.152: U$10.P$5 J10.1
N$13
  Bottom 0.152: J11.1 U$10.P$6
N$14
  Bottom 0.152: U$10.P$7 J12.1
N$15
  Bottom 0.152: J13.1 U$10.P$8
N$16
  Top 0.152: J14.1 U$10.P$27
N$17
  Top 0.152: U$10.P$28 J15.1
N$18
  Top 0.152: U$10.P$26 J16.1
N$19
  Top 0.152: J17.1 101.35,77.72 106.98,77.72 111.71,82.45 115.52,82.45 U$10.P$20
N$20
  Top 0.152: U$10.P$19 115.52,85.19 100.43,85.19 J18.1
N$21
  Top 0.152: J20.8 33.07,35.51 33.02,35.51
  Top 0.406: J19.8 J20.8 33.02,35.51 J21.8 J22.8 J23.8
N$22
  Top 0.406: J23.7 J22.7 J21.7 J20.7 J19.7
N$23
  Top 0.406: J19.6 J20.6 J21.6 J22.6 J23.6
N$24
  Top 0.406: J23.5 J22.5 J21.5 J20.5 J19.5
N$25
  Top 0.406: J19.4 J20.4 J21.4 J22.4 J23.4
N$26
  Top 0.406: J23.3 J22.3 J21.3 J20.3 J19.3
N$27
  Top 0.406: J19.2 J20.2 J21.2 J22.2 J23.2
N$28
  Top 0.406: J23.1 J22.1 J21.1 J20.1 J19.1
RCK
  Top 0.152: U$5.P$18 83.82,60.96 U$1.12
RRST
  Top 0.152: U$1.21 80.31,72.08 88.7,72.08 92.35,68.43 92.35,53.95 89,50.6 89,34.29 U$5.P$22
V+
  Bottom 0.152: U$4.3 144.83,82.55 143.9,83.48 143.12,83.48 141.94,82.3 141.94,82.16 141.4,81.62 4.74,81.62 J1.2
VIN  (via drill 0.35)
  Top 0.152: v49.07,80.92 35.66,67.51 35.66,64.77 U$3.3
  Bottom 0.152: 123.75,62.63 124.14,63.01 130.71,63.01 143.51,75.82 U$4.2 | 123.75,62.63 123.68,62.55 123.68,46.21 HBRIDGE.P$9 | v49.07,80.92 100.58,80.92 118.87,62.64 123.75,62.64 123.75,62.63
VSY
  Top 0.152: U$5.P$5 68.58,28.04 70.1,28.04 70.87,28.8 79.25,28.8 80.92,27.13 81.69,27.13 82.6,28.04 82.6,29.41 87.17,33.98 87.17,34.59 86.56,35.2 85.95,35.2 84.12,33.38 83.52,33.38 82.91,33.98 82.91,62.64 86.26,65.99 U$1.11
WR
  Top 0.152: U$5.P$19 86.41,28.04 86.41,30.63 93.88,38.1 93.88,65.99 U$1.14
WRST
  Bottom 0.152: U$5.P$21 88.85,28.04 88.85,33.22 82.45,39.62 82.45,60.35 77.11,65.68 77.11,72.69 76.2,73.61 U$1.22